# Altium project pca10056.PrjPCB (part 5 of 5)
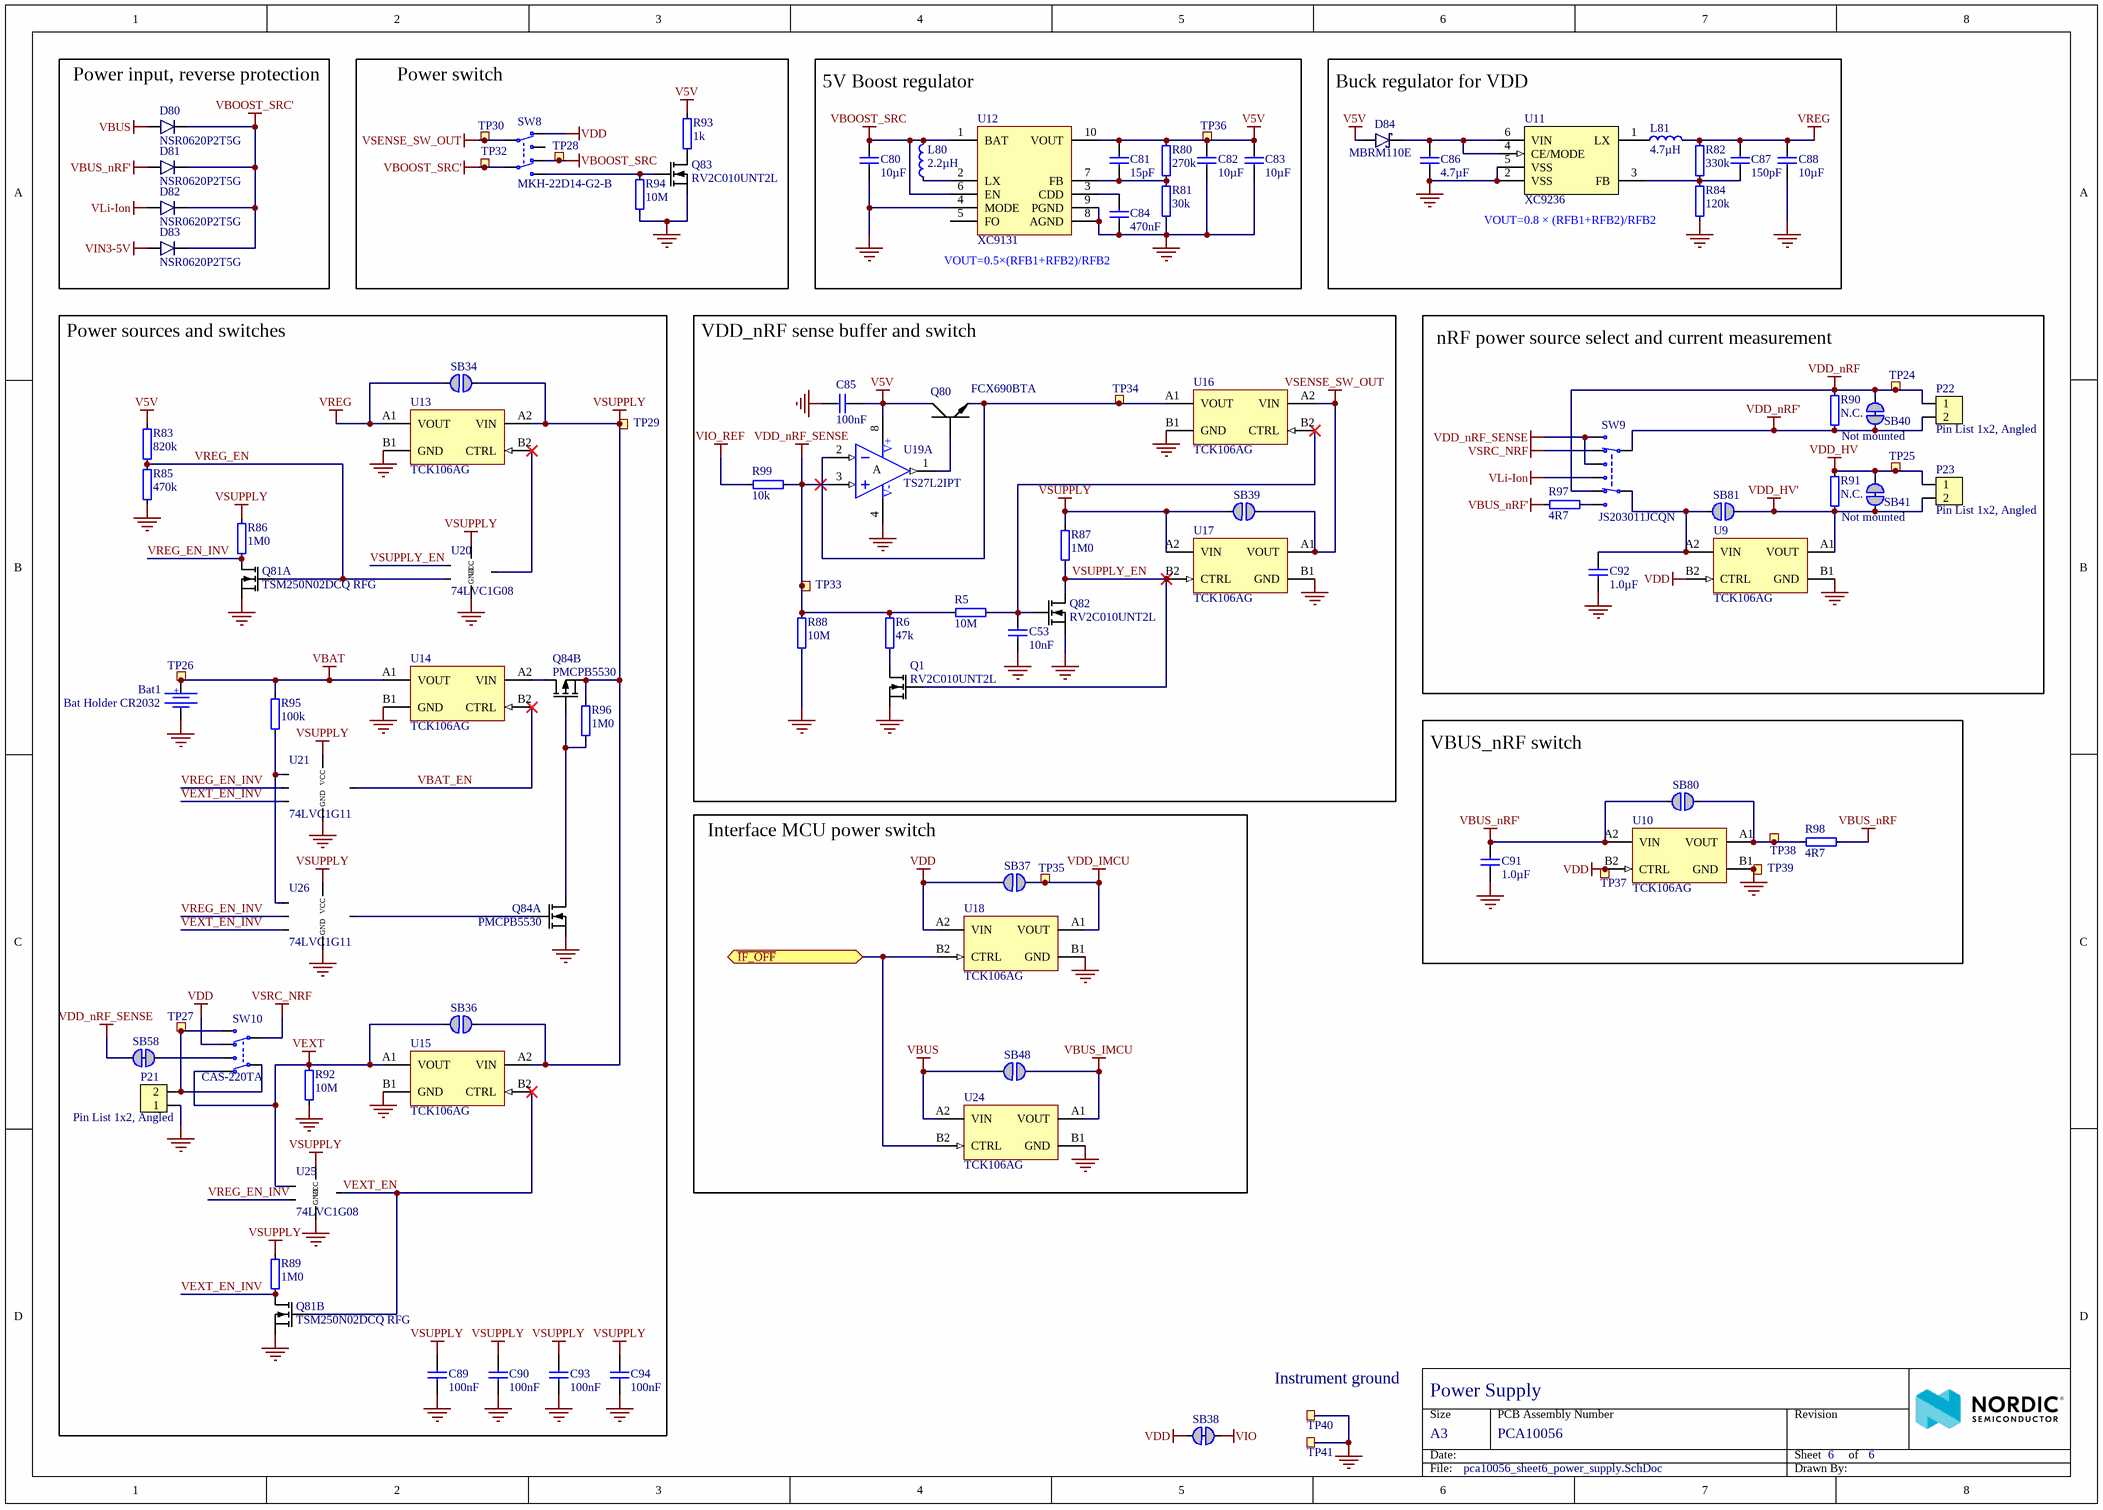
[diagram p6: pca10056_sheet6_power_supply.SchDoc]

## Nets that join several sheets
GND: pca10056_sheet2_nrf52840_mcu (31 pins), pca10056_sheet3_interface_mcu (32 pins), pca10056_sheet4_misc (27 pins), pca10056_sheet5_connectors (83 pins), pca10056_sheet6_power_supply (52 pins)
V5V: pca10056_sheet5_connectors (5 pins), pca10056_sheet6_power_supply (12 pins)
VBUS: pca10056_sheet3_interface_mcu (J4.5), pca10056_sheet4_misc (Q40.2 R40.1), pca10056_sheet5_connectors (C69.2 FB61.2), pca10056_sheet6_power_supply (D80.2 SB48.2 U24.A2)
VBUS_IMCU: pca10056_sheet3_interface_mcu (R7.2 R13.1), pca10056_sheet6_power_supply (SB48.1 U24.A1)
VBUS_nRF: pca10056_sheet2_nrf52840_mcu (C21.1 U1.AD2), pca10056_sheet6_power_supply (R98.2)
VBUS_nRF': pca10056_sheet5_connectors (C68.2 FB60.2), pca10056_sheet6_power_supply (5 pins)
VDD: pca10056_sheet4_misc (19 pins), pca10056_sheet5_connectors (R68.2 SB47.1 SB59.2), pca10056_sheet6_power_supply (8 pins)
VDD_HV: pca10056_sheet2_nrf52840_mcu (C19.1 U1.Y2), pca10056_sheet5_connectors (P20.10 P26.10), pca10056_sheet6_power_supply (P23.1 R91.2 SB41.1 TP25.1)
VDD_HV': pca10056_sheet5_connectors (P20.11 P26.11), pca10056_sheet6_power_supply (5 pins)
VDD_IMCU: pca10056_sheet3_interface_mcu (30 pins), pca10056_sheet6_power_supply (SB37.1 TP35.1 U18.A1)
VDD_nRF: pca10056_sheet2_nrf52840_mcu (11 pins), pca10056_sheet4_misc (SB18.1), pca10056_sheet5_connectors (P20.1 P26.1), pca10056_sheet6_power_supply (5 pins)
VDD_nRF': pca10056_sheet5_connectors (P20.2 P26.2 SB60.2), pca10056_sheet6_power_supply (P22.2 R90.1 SB40.2 SW9.3)
VIN3-5V: pca10056_sheet5_connectors (P20.9 P26.9), pca10056_sheet6_power_supply (D83.2)
VIO: pca10056_sheet5_connectors (9 pins), pca10056_sheet6_power_supply (SB38.1)
VIO_REF: pca10056_sheet5_connectors (P20.12 P26.12 SB19.2), pca10056_sheet6_power_supply (R99.2)
VLi-Ion: pca10056_sheet5_connectors (J6.2 P27.2 TP31.1), pca10056_sheet6_power_supply (D82.2 SW9.5)
D_N: pca10056_sheet2_nrf52840_mcu (U1.AD4), pca10056_sheet5_connectors (D60.2 J3.2 TP13.1)
D_P: pca10056_sheet2_nrf52840_mcu (U1.AD6), pca10056_sheet5_connectors (D60.3 J3.3 TP14.1)
~{IF_OFF}: pca10056_sheet4_misc (6 pins), pca10056_sheet6_power_supply (U18.B2 U24.B2)
IMCU_BOOT: pca10056_sheet3_interface_mcu (U2.AL27), pca10056_sheet4_misc (SB46.2 U7.15)
IMCU_N: pca10056_sheet3_interface_mcu (U2.B4), pca10056_sheet5_connectors (D61.2 J2.2 TP10.1)
IMCU_P: pca10056_sheet3_interface_mcu (U2.B2), pca10056_sheet5_connectors (D61.3 J2.3 TP9.1)
NetP6_7: pca10056_sheet2_nrf52840_mcu (R43.1), pca10056_sheet5_connectors (P6.7 P12.7 P17.14)
NetP6_8: pca10056_sheet2_nrf52840_mcu (R45.1), pca10056_sheet5_connectors (P6.8 P12.8 P17.16)
NetP19_2: pca10056_sheet3_interface_mcu (R11.2), pca10056_sheet5_connectors (P19.2)
NetP19_4: pca10056_sheet3_interface_mcu (R12.2), pca10056_sheet5_connectors (P19.4)
NetP19_6: pca10056_sheet3_interface_mcu (R14.2), pca10056_sheet5_connectors (P19.6)
NetP19_10: pca10056_sheet3_interface_mcu (R15.2), pca10056_sheet5_connectors (P19.10)
NetP20_3: pca10056_sheet3_interface_mcu (Q3.1 R20.1), pca10056_sheet5_connectors (P20.3 P26.3)
NetP20_4: pca10056_sheet3_interface_mcu (R16.2), pca10056_sheet5_connectors (P20.4 P26.4)
NetP20_5: pca10056_sheet3_interface_mcu (R17.2), pca10056_sheet5_connectors (P20.5 P26.5)
NetP20_6: pca10056_sheet3_interface_mcu (R18.2), pca10056_sheet5_connectors (P20.6 P26.6)
NetP20_7: pca10056_sheet3_interface_mcu (R19.2), pca10056_sheet5_connectors (P20.7 P26.7)
NetP24_7: pca10056_sheet2_nrf52840_mcu (SB23.2), pca10056_sheet5_connectors (P24.7)
NetP24_9: pca10056_sheet2_nrf52840_mcu (SB21.2), pca10056_sheet5_connectors (P24.9)
NetP24_10: pca10056_sheet2_nrf52840_mcu (SB22.2), pca10056_sheet5_connectors (P24.10)
NetP24_11: pca10056_sheet2_nrf52840_mcu (SB24.2), pca10056_sheet5_connectors (P24.11)
NetP24_12: pca10056_sheet2_nrf52840_mcu (SB25.2), pca10056_sheet5_connectors (P24.12)
NetP24_13: pca10056_sheet2_nrf52840_mcu (SB20.2), pca10056_sheet5_connectors (P24.13)
NetR68_1: pca10056_sheet4_misc (U7.10), pca10056_sheet5_connectors (R68.1 SB33.2 TP19.1)
NetSB10_2: pca10056_sheet2_nrf52840_mcu (SB10.2), pca10056_sheet4_misc (U3.7)
NetSB11_2: pca10056_sheet2_nrf52840_mcu (SB11.2), pca10056_sheet4_misc (U3.6)
NetSB12_2: pca10056_sheet2_nrf52840_mcu (SB12.2), pca10056_sheet4_misc (U3.5)
NetSB13_2: pca10056_sheet2_nrf52840_mcu (SB13.2), pca10056_sheet4_misc (U3.1)
NetSB14_2: pca10056_sheet2_nrf52840_mcu (SB14.2), pca10056_sheet4_misc (U3.2)
NetSB15_2: pca10056_sheet2_nrf52840_mcu (SB15.2), pca10056_sheet4_misc (U3.3)
NFC1: pca10056_sheet4_misc (C46.1 R44.1), pca10056_sheet5_connectors (J5.2 TP17.1)
NFC2: pca10056_sheet4_misc (C47.2 R46.1), pca10056_sheet5_connectors (J5.4 TP18.1)
P0.00: pca10056_sheet2_nrf52840_mcu (SB4.2), pca10056_sheet5_connectors (P6.1 P12.1 P17.2)
P0.01: pca10056_sheet2_nrf52840_mcu (SB3.2), pca10056_sheet5_connectors (P6.2 P12.2 P17.4)
P0.02/AIN0: pca10056_sheet2_nrf52840_mcu (U1.A12), pca10056_sheet5_connectors (P4.8 P10.8 P16.16)
P0.03/AIN1: pca10056_sheet2_nrf52840_mcu (U1.B13), pca10056_sheet5_connectors (P2.1 P8.1 P14.2 TP42.1)
P0.04/AIN2: pca10056_sheet2_nrf52840_mcu (U1.J1), pca10056_sheet4_misc (U8.15), pca10056_sheet5_connectors (P2.2 P8.2 P14.4 TP43.1)
P0.05/AIN3: pca10056_sheet2_nrf52840_mcu (U1.K2), pca10056_sheet4_misc (SB51.1), pca10056_sheet5_connectors (P6.3 P12.3 P17.6)
P0.06: pca10056_sheet2_nrf52840_mcu (U1.L1), pca10056_sheet4_misc (SB53.1), pca10056_sheet5_connectors (P6.4 P12.4 P17.8)
P0.07: pca10056_sheet2_nrf52840_mcu (U1.M2), pca10056_sheet4_misc (U8.1), pca10056_sheet5_connectors (P6.5 P12.5 P17.10 P25.12)
P0.08: pca10056_sheet2_nrf52840_mcu (U1.N1), pca10056_sheet4_misc (SB52.1), pca10056_sheet5_connectors (P6.6 P12.6 P17.12)
P0.09/NFC1: pca10056_sheet2_nrf52840_mcu (R43.2 U1.L24), pca10056_sheet4_misc (R44.2)
P0.10/NFC2: pca10056_sheet2_nrf52840_mcu (R45.2 U1.J24), pca10056_sheet4_misc (R46.2)
P0.11: pca10056_sheet2_nrf52840_mcu (U1.T2), pca10056_sheet4_misc (U8.5), pca10056_sheet5_connectors (P24.1 P25.18)
P0.12: pca10056_sheet2_nrf52840_mcu (U1.U1), pca10056_sheet4_misc (U8.9), pca10056_sheet5_connectors (P24.2 P25.16)
P0.13: pca10056_sheet2_nrf52840_mcu (U1.AD8), pca10056_sheet4_misc (SB5.1), pca10056_sheet5_connectors (P24.3)
P0.14: pca10056_sheet2_nrf52840_mcu (U1.AC9), pca10056_sheet4_misc (SB6.1), pca10056_sheet5_connectors (P24.4)
P0.15: pca10056_sheet2_nrf52840_mcu (U1.AD10), pca10056_sheet4_misc (SB7.1), pca10056_sheet5_connectors (P24.5)
P0.16: pca10056_sheet2_nrf52840_mcu (U1.AC11), pca10056_sheet4_misc (SB8.1), pca10056_sheet5_connectors (P24.6)
P0.18/RESET: pca10056_sheet2_nrf52840_mcu (U1.AC13), pca10056_sheet4_misc (SB42.2 SB44.2 SB45.2 SB56.1), pca10056_sheet5_connectors (P18.10 P24.8 P25.10)
P0.24: pca10056_sheet2_nrf52840_mcu (U1.AD20), pca10056_sheet4_misc (SW3.2), pca10056_sheet5_connectors (P24.14)
P0.25: pca10056_sheet2_nrf52840_mcu (U1.AC21), pca10056_sheet4_misc (SW4.2), pca10056_sheet5_connectors (P24.15)
P0.28/AIN4: pca10056_sheet2_nrf52840_mcu (U1.B11), pca10056_sheet5_connectors (P2.3 P8.3 P14.6 TP44.1)
P0.29/AIN5: pca10056_sheet2_nrf52840_mcu (U1.A10), pca10056_sheet5_connectors (P2.4 P8.4 P14.8 TP45.1)
P0.30/AIN6: pca10056_sheet2_nrf52840_mcu (U1.B9), pca10056_sheet5_connectors (P2.5 P8.5 P14.10 TP46.1)
P0.31/AIN7: pca10056_sheet2_nrf52840_mcu (U1.A8), pca10056_sheet5_connectors (P2.6 P8.6 P14.12 TP47.1)
P1.00: pca10056_sheet2_nrf52840_mcu (U1.AD22), pca10056_sheet4_misc (SB57.1), pca10056_sheet5_connectors (P18.6 P24.16 P25.6 P25.14)
P1.01: pca10056_sheet2_nrf52840_mcu (U1.Y23), pca10056_sheet5_connectors (P3.1 P9.1 P15.2)
P1.02: pca10056_sheet2_nrf52840_mcu (U1.W24), pca10056_sheet5_connectors (P3.2 P9.2 P15.4)
P1.03: pca10056_sheet2_nrf52840_mcu (U1.V23), pca10056_sheet5_connectors (P3.3 P9.3 P15.6)
P1.04: pca10056_sheet2_nrf52840_mcu (U1.U24), pca10056_sheet5_connectors (P3.4 P9.4 P15.8)
P1.05: pca10056_sheet2_nrf52840_mcu (U1.T23), pca10056_sheet5_connectors (P3.5 P9.5 P15.10)
P1.06: pca10056_sheet2_nrf52840_mcu (U1.R24), pca10056_sheet5_connectors (P3.6 P9.6 P15.12)
P1.07: pca10056_sheet2_nrf52840_mcu (U1.P23), pca10056_sheet4_misc (U8.3), pca10056_sheet5_connectors (P3.7 P9.7 P15.14)
P1.08: pca10056_sheet2_nrf52840_mcu (U1.P2), pca10056_sheet4_misc (U8.7), pca10056_sheet5_connectors (P3.8 P9.8 P15.16)
P1.09: pca10056_sheet2_nrf52840_mcu (U1.R1), pca10056_sheet5_connectors (P24.17 P25.20)
P1.10: pca10056_sheet2_nrf52840_mcu (U1.A20), pca10056_sheet5_connectors (P4.1 P10.1 P16.2)
P1.11: pca10056_sheet2_nrf52840_mcu (U1.B19), pca10056_sheet5_connectors (P4.2 P10.2 P16.4)
P1.12: pca10056_sheet2_nrf52840_mcu (U1.B17), pca10056_sheet5_connectors (P4.3 P10.3 P16.6)
P1.13: pca10056_sheet2_nrf52840_mcu (U1.A16), pca10056_sheet5_connectors (5 pins)
P1.14: pca10056_sheet2_nrf52840_mcu (U1.B15), pca10056_sheet5_connectors (5 pins)
P1.15: pca10056_sheet2_nrf52840_mcu (U1.A14), pca10056_sheet5_connectors (5 pins)
RESET_PIN: pca10056_sheet4_misc (SB43.2 SB44.1 U7.4), pca10056_sheet5_connectors (5 pins)
SCL: pca10056_sheet2_nrf52840_mcu (R2.1), pca10056_sheet4_misc (U7.12), pca10056_sheet5_connectors (P4.10 P10.10 P16.20)
SDA: pca10056_sheet2_nrf52840_mcu (R1.1), pca10056_sheet4_misc (U7.8), pca10056_sheet5_connectors (P4.9 P10.9 P16.18)
SWD0_SEL: pca10056_sheet3_interface_mcu (U2.B24), pca10056_sheet5_connectors (P19.3)
SWD3_CLK: pca10056_sheet3_interface_mcu (U2.R1), pca10056_sheet4_misc (TP6.1 U6.3)
SWD3_IO: pca10056_sheet3_interface_mcu (U2.N1), pca10056_sheet4_misc (TP5.1 U6.15)
SWD3_RESET: pca10056_sheet3_interface_mcu (U2.AA1), pca10056_sheet4_misc (TP7.1 U6.7)
SWD3_SWO: pca10056_sheet3_interface_mcu (U2.W1), pca10056_sheet4_misc (TP8.1 U6.11)
SWDCLK: pca10056_sheet2_nrf52840_mcu (U1.AA24), pca10056_sheet4_misc (SB55.1), pca10056_sheet5_connectors (P18.4 P25.4)
SWDIO: pca10056_sheet2_nrf52840_mcu (U1.AC24), pca10056_sheet4_misc (SB54.1), pca10056_sheet5_connectors (P18.2 P25.2)
VCOM_CTS: pca10056_sheet3_interface_mcu (R10.1 U2.AL9), pca10056_sheet4_misc (TP1.1 U5.4)
VCOM_RTS: pca10056_sheet3_interface_mcu (U2.AL5), pca10056_sheet4_misc (TP3.1 U5.16)
VCOM_RxD: pca10056_sheet3_interface_mcu (U2.AL19), pca10056_sheet4_misc (TP2.1 U5.11)
VCOM_TxD: pca10056_sheet3_interface_mcu (U2.U31), pca10056_sheet4_misc (TP4.1 U5.7)